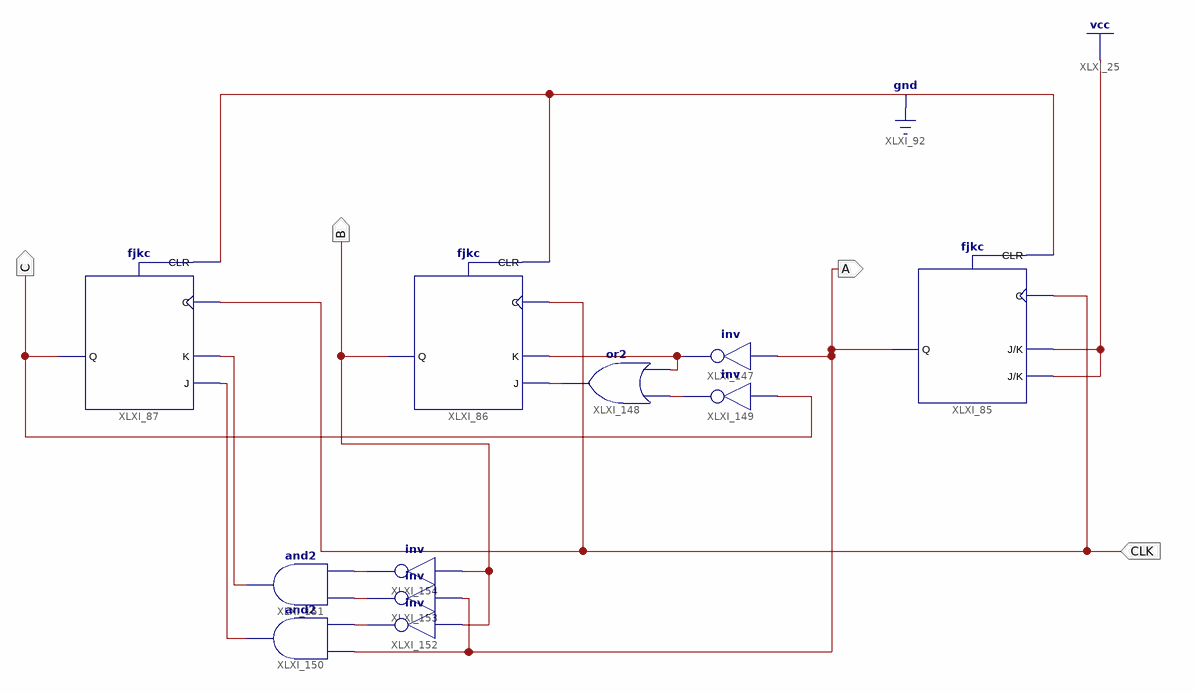
[diagram p0: schematic sheet 1]
// Xilinx ISE schematic countdown1_6.sch (spartan6) as structural Verilog: 11 symbols, 4 ports
module countdown1_6 (
  input  CLK,
  output C,
  output A,
  output B
);

  wire XLXN_219, XLXN_220, XLXN_221, XLXN_223, XLXN_227, XLXN_228, XLXN_229, XLXN_230;

  fjkc XLXI_85 (.C(CLK), .CLR(1'b0), .J(1'b1), .K(1'b1), .Q(A));
  fjkc XLXI_87 (.C(CLK), .CLR(1'b0), .J(XLXN_223), .K(XLXN_227), .Q(C));
  fjkc XLXI_86 (.C(CLK), .CLR(1'b0), .J(XLXN_220), .K(XLXN_219), .Q(B));
  not XLXI_147 (XLXN_219, A);
  or XLXI_148 (XLXN_220, XLXN_221, XLXN_219);
  not XLXI_149 (XLXN_221, C);
  and XLXI_150 (XLXN_223, A, XLXN_230);
  and XLXI_151 (XLXN_227, XLXN_229, XLXN_228);
  not XLXI_154 (XLXN_228, B);
  not XLXI_153 (XLXN_229, A);
  not XLXI_152 (XLXN_230, B);
endmodule
